# EAGLE board lost60V3 (EAGLE 9.6.0), part 1 of 3
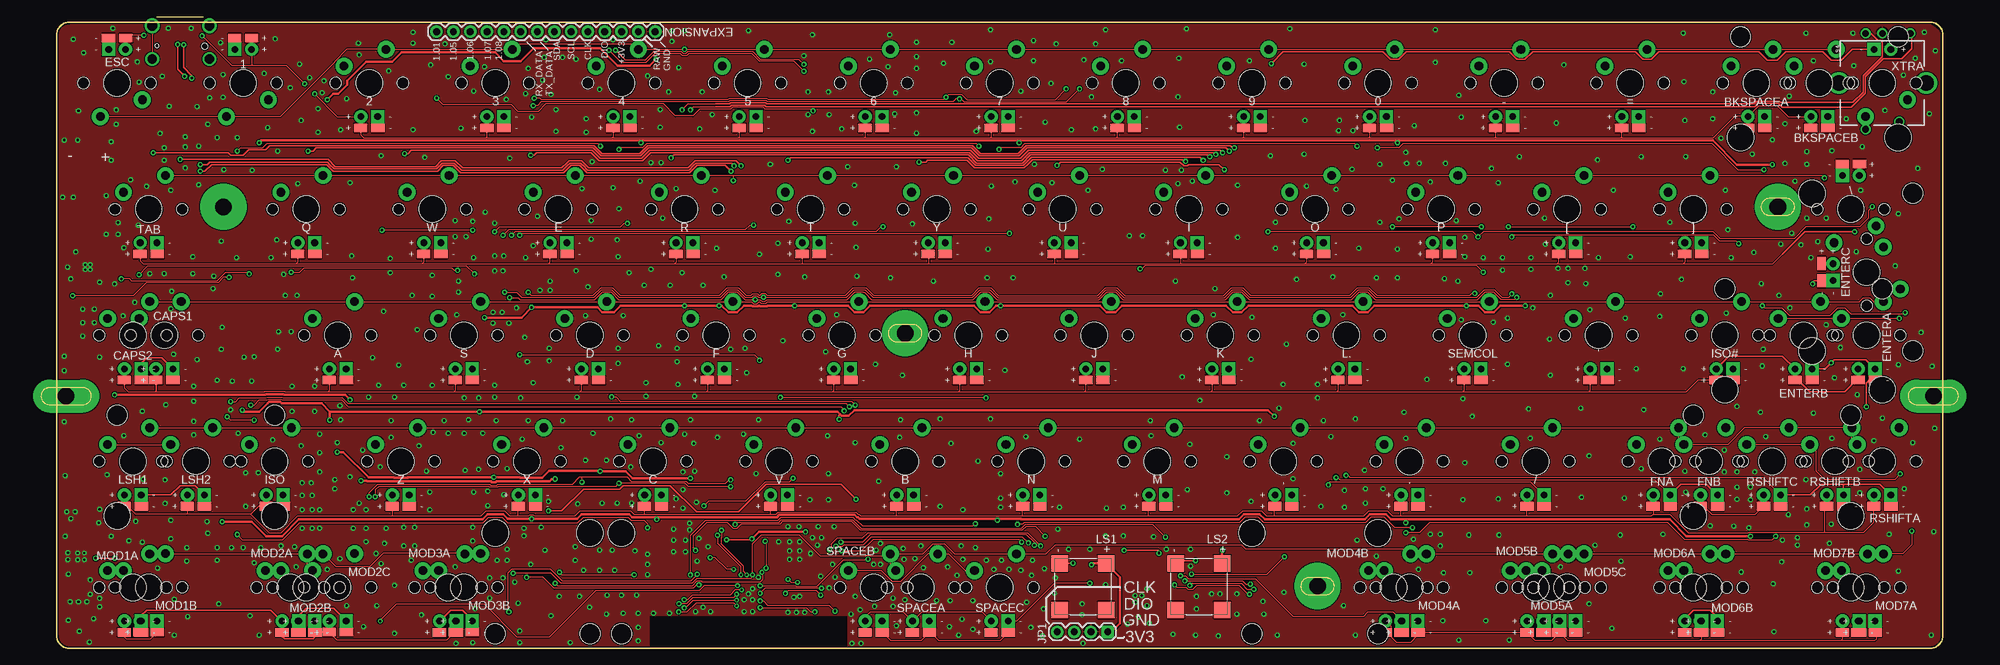
[diagram p8: board, top side]
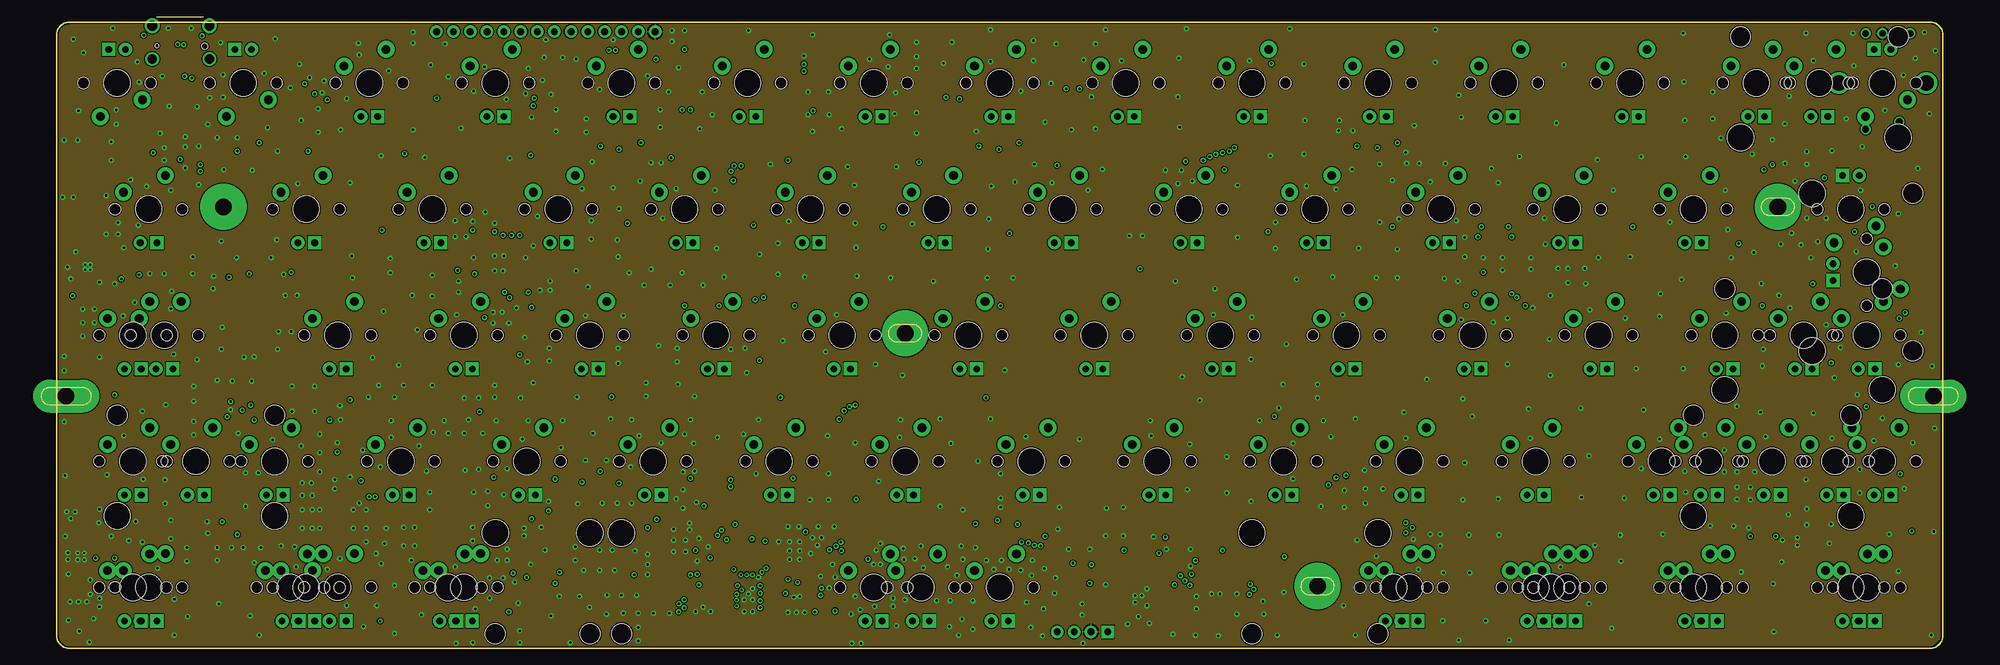
[diagram p9: board, inner layer Route2]
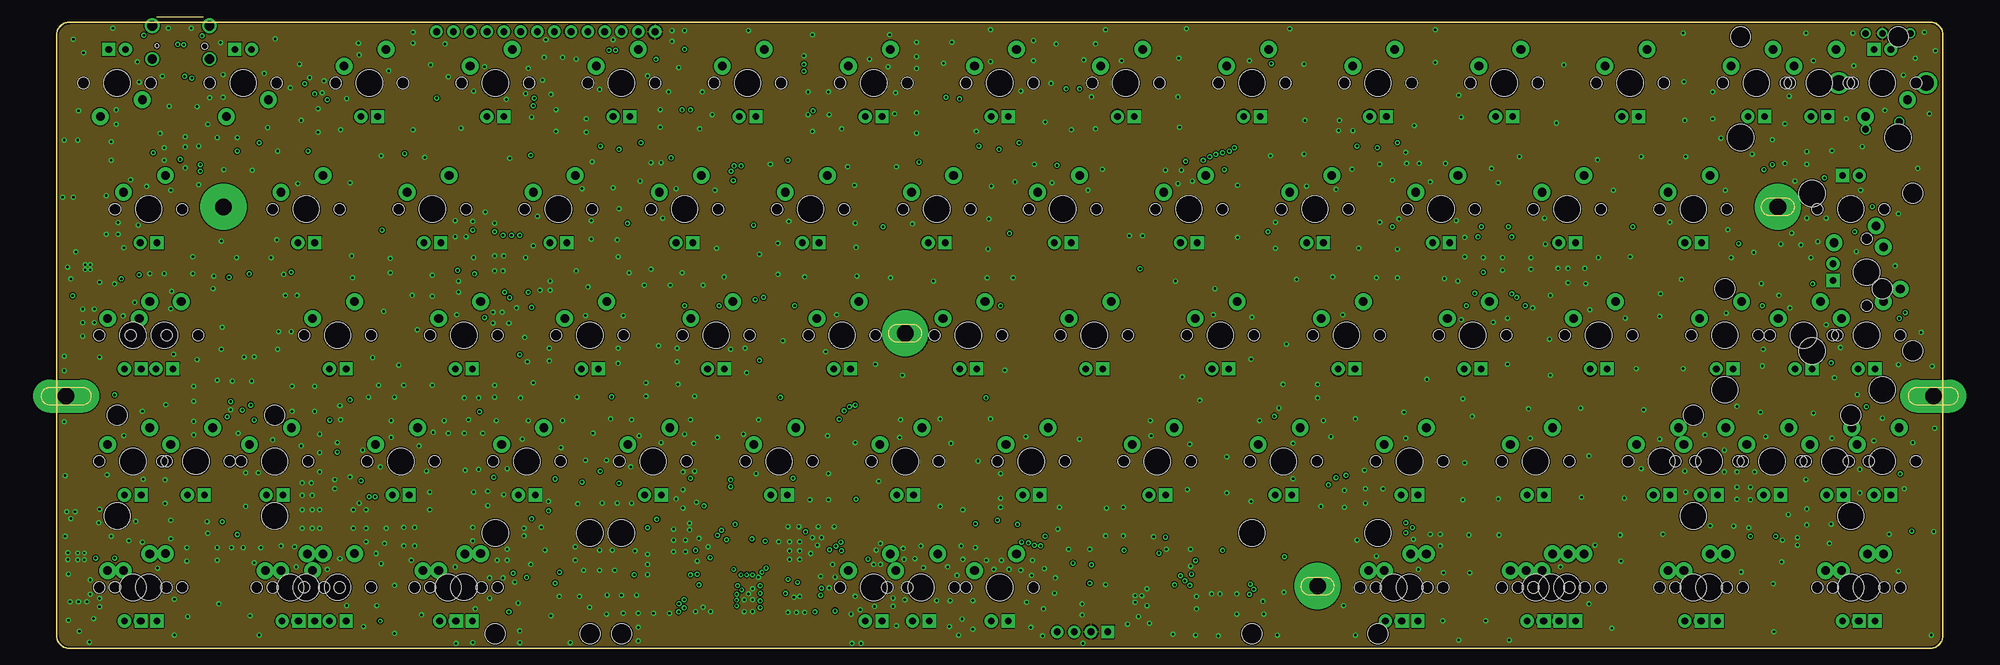
[diagram p10: board, inner layer Route15]
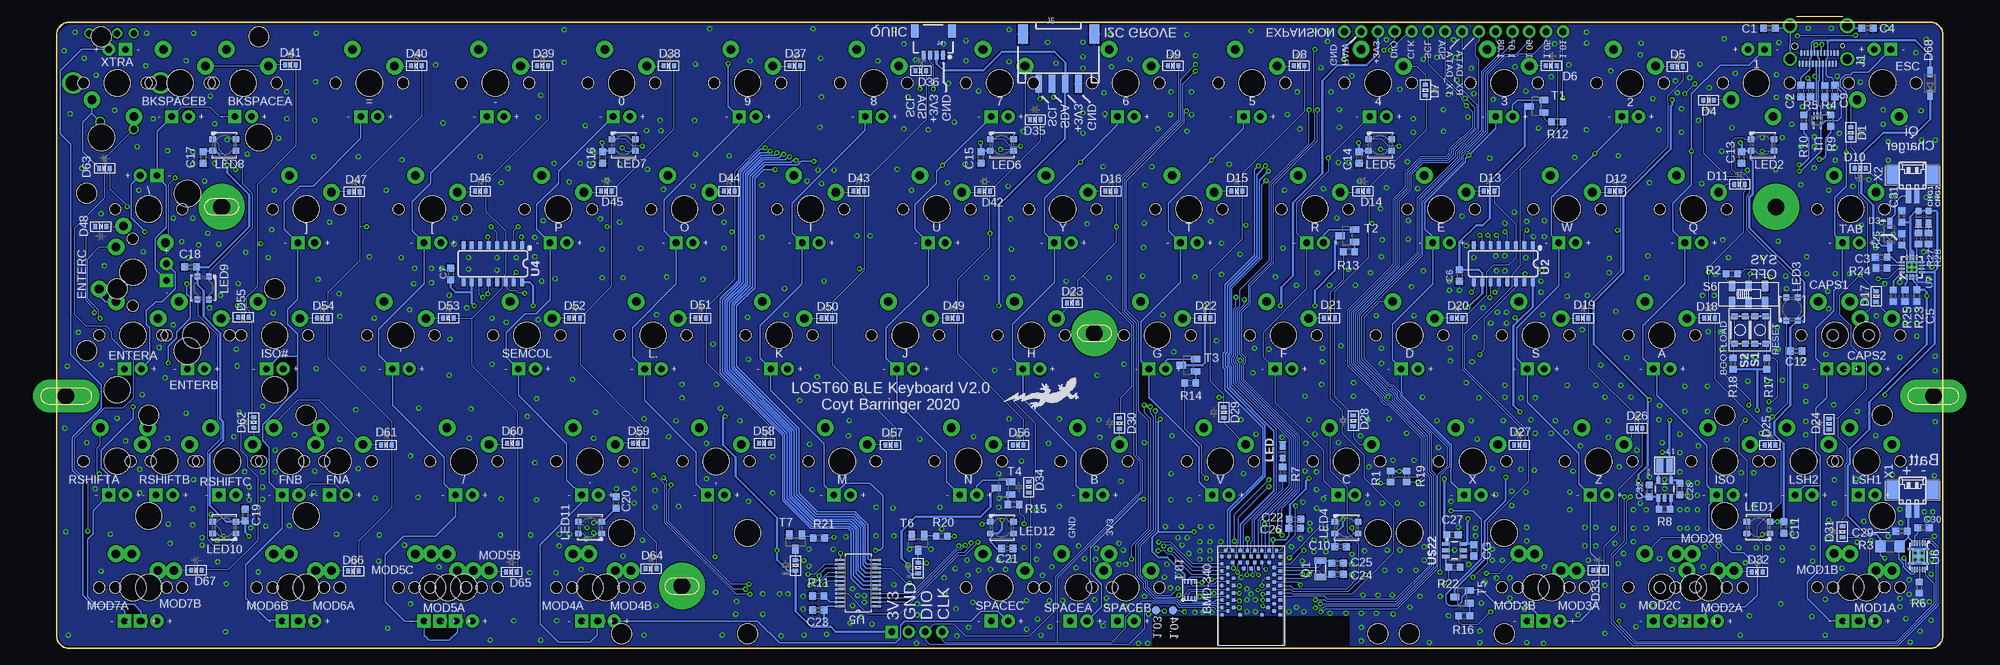
[diagram p11: board, bottom side, seen from below]

Size 285 x 95.44 mm. Coordinates in mm from the lower left corner, seen from the top.
Outline: 15.13,95.44 22.13,95.44
Outline: 0,2 arc90 2,0 283,0 arc90 285,2 285,92.6 arc90 283,94.6 2,94.6 arc90 0,92.6 0,2
Copper layers (1*16): Top 0.035mm / dielectric 1.5mm / Bottom 0.035mm
Design rules "default *": minimum track width 6mil, minimum drill 12mil, track to track 6mil, track to pad 6mil, pad to pad 6mil, via to via 6mil, smd to smd 6mil, copper to edge 8mil, drill to drill 4mil, minimum pad ring 10mil, minimum via ring 8mil, stop-mask expansion 4mil, vias tented up to drill 15mil, thermal gap 10mil

## Footprints (pad centres in the part's own frame; a part is rotated, then mirrored left to right if it is on the bottom)
MX-1U-THTSMDLED = drill 1 pad 2: LED+ -1.27,-5.08 | drill 1 pad 2 square: LED- 1.27,-5.08 | drill 1.3 pad 2.54: MX1 -3.81,2.54; MX2 2.54,5.08 | smd 2 x 1.3: SMDLED+ -1.3,-6.785; SMDLED- 1.3,-6.785 | hole 4: 0,0 | hole 1.7: -5.08,0; 5.08,0
MX-2U-THTSMDLED = drill 1 pad 2: LED+ -1.27,-5.08 | drill 1 pad 2 square: LED- 1.27,-5.08 | drill 1.3 pad 2.54: MX1 -3.81,2.54; MX2 2.54,5.08 | smd 2 x 1.3: SMDLED+ -1.3,-6.785; SMDLED- 1.3,-6.785 | hole 4: 0,0; -11.9,-8.24; 11.9,-8.24 | hole 1.7: -5.08,0; 5.08,0 | hole 3.05: -11.9,7; 11.9,7
BMD-340 = smd 0.5 x 0.5: P1 0.5,9.35; P2 1.4,8.8; P3 0.5,8.25; P4 1.4,7.7; P5 0.5,7.15; P6 1.4,6.6; P7 0.5,6.05; P8 1.4,5.5; P9 0.5,4.95; P10 1.4,4.4; P11 0.5,3.85; P12 1.4,3.3; P13 0.5,2.75; P14 1.4,2.2; P15 0.5,1.65; P16 0.5,0.55; P17 1.6,0.55; P18 2.15,1.45; P19 2.7,0.55; P20 3.25,1.45; P21 3.8,0.55; P22 4.35,1.45; P23 4.9,0.55; P24 5.45,1.45; P25 6,0.55; P26 6.55,1.45; P27 7.1,0.55; P28 7.65,1.45; P29 8.2,0.55; P30 9.3,0.55; P31 9.3,1.65; P32 8.4,2.2; P33 9.3,2.75; P34 8.4,3.3; P35 9.3,3.85; P36 8.4,4.4; P37 9.3,4.95; P38 8.4,5.5; P39 9.3,6.05; P40 8.4,6.6; P41 9.3,7.15; P42 8.4,7.7; P43 9.3,8.25; P44 8.4,8.8; P45 9.3,9.35; P46 6.55,9.35; P47 3.25,9.35; P48 2.3,8.25; P49 2.3,7.15; P50 2.3,6.05; P51 2.3,4.95; P52 2.3,3.85; P53 3.79,2.35; P54 4.9,2.35; P55 6,2.35; P56 7.5,3.85; P57 7.5,4.95; P58 7.5,6.05; P59 7.5,7.15; P60 7.5,8.25; P61 1.05,-0.35; P62 2.15,-0.35; P63 3.25,-0.35; P64 4.35,-0.35; P65 5.45,-0.35; P66 6.55,-0.35; P67 7.65,-0.35; P68 8.75,-0.35
C0603K = smd 1.05 x 1.08: 1 -0.875,0; 2 0.875,0
C0603 = smd 1.1 x 1: 1 -0.85,0; 2 0.85,0
LED-0603 = smd 1 x 1: A -0.877,0; C 0.877,0
SOD-523 = smd 0.8 x 0.6: A 0,-0.8; K 0,0.8
SOD123 = smd 1.6 x 0.8: 1 -1.7,0; 2 1.7,0
1X14 = drill 1.016 pad 1.88: 1 0,0; 2 2.54,0; 3 5.08,0; 4 7.62,0; 5 10.16,0; 6 12.7,0; 7 15.24,0; 8 17.78,0; 9 20.32,0; 10 22.86,0; 11 25.4,0; 12 27.94,0; 13 30.48,0; 14 33.02,0
GH60HOLETYPE3 = drill 2.499 pad 7.001: P$1 0,0
DX07S0224JJ2_USB-C = smd 0.27 x 0.9: A1 0.975,2.7; A2 1.475,2.7; A3 1.975,2.7; A4 2.475,2.7; A5 2.975,2.7; A6 3.475,2.7; A7 3.975,2.7; A8 4.475,2.7; A9 4.975,2.7; A10 5.475,2.7; A11 5.975,2.7; A12 6.475,2.7 | smd 0.27 x 0.8: B1 6.225,1.1; B2 5.725,1.1; B3 5.225,1.1; B4 4.725,1.1; B5 4.225,1.1; B6 3.725,1.1; B7 3.225,1.1; B8 2.725,1.1; B9 2.225,1.1; B10 1.725,1.1; B11 1.225,1.1; B12 0.725,1.1 | drill 1.4: SHIELD0 -0.72,2; SHIELD1 7.92,2 | drill 1.5: SHIELD2 7.92,-3.05; SHIELD3 -0.72,-3.05 | hole 0.6: 0,0; 0,0 | hole 0.9: 7.2,0.065
1X04_1MM_RA = smd 0.6 x 1.35: 1 -1.5,0; 2 -0.5,0; 3 0.5,0; 4 1.5,0 | smd 1.2 x 2: NC1 2.8,-3.675; NC2 -2.8,-3.675
HW4-SMD-2.0-90D = smd 1.01 x 2.74: 1 -3,-0.1; 2 -1,-0.1; 3 1,-0.1; 4 3,-0.1 | smd 1.5 x 3: SS1 -5.4,7.4; SS2 5.4,7.4
1X04 = drill 1.016 pad 1.88 square: 1 0,0 | drill 1.016 pad 1.88: 2 2.54,0; 3 5.08,0; 4 7.62,0
MICROBUILDER_INDUCTOR_TAIYOYUDEN_NRH2412T = smd 1 x 2: 1 -0.725,0; 2 0.725,0
LED3535 = smd 1 x 0.85: 1 -1.75,0.875; 2 -1.75,-0.875; 3 1.75,-0.875; 4 1.75,0.875
CUI_CMT-8530S-SMT = smd 2.5 x 2.5: 1 -3.5,3.5; 2 -3.5,-3.5; N 3.5,3.5; P 3.5,-3.5
3.2X1.5 = smd 1 x 1.8: 1 -1.25,0; 2 1.25,0
R0603 = smd 1 x 1.1: 1 -0.85,0; 2 0.85,0
R1206 = smd 1.6 x 1.803: 1 -1.422,0; 2 1.422,0
TACTILE_SWITCH_SMD_4.6X2.8MM = smd 0.9 x 1: 1 -2.05,-0.8; 2 2.05,-0.8; 3 2.05,0.8; 4 -2.05,0.8
ROTARY_ENC_PLAIN-MOD1 = drill 1.016: A 7.493,-4.191; B 7.493,2.54; C 7.493,0; SW+ -6.985,2.54; SW- -5.842,-2.54 | drill 2.286: P$3 0,6.604; P$4 0,-6.604
JS202011JCQN = smd 1 x 1.6: 1 -2.5,1.2; 2 0,1.2; 3 2.5,1.2; 4 -2.5,-1.2; 5 0,-1.2; 6 2.5,-1.2
MX-6.25U-THTSMDLED-FLIPPED = drill 1 pad 2: LED+ -1.27,-5.08 | drill 1 pad 2 square: LED- 1.27,-5.08 | drill 1.3 pad 2.54: MX1 -3.81,2.54; MX2 2.54,5.08 | smd 2 x 1.3: SMDLED+ -1.3,-6.785; SMDLED- 1.3,-6.785 | hole 4: 0,0; -50,8.24; 50,8.24 | hole 1.7: -5.08,0; 5.08,0 | hole 3.05: -50,-7; 50,-7
MX-7U-THTSMDLED-FLIPPED = drill 1 pad 2: LED+ -1.27,-5.08 | drill 1 pad 2 square: LED- 1.27,-5.08 | drill 1.3 pad 2.54: MX1 -3.81,2.54; MX2 2.54,5.08 | smd 2 x 1.3: SMDLED+ -1.3,-6.785; SMDLED- 1.3,-6.785 | hole 4: 0,0; -57.15,8.24; 57.15,8.24 | hole 1.7: -5.08,0; 5.08,0 | hole 3.05: -57.15,-7; 57.15,-7
SOT23 = smd 1 x 1.4: 1 -0.95,-1.1; 2 0.95,-1.1; 3 0,1.1
PAD.03X.05 = smd 1.27 x 1.27: P$1 0,0
SOT50P160X60-5N = smd 1.118 x 0.254: 1 -0.737,0.508; 2 -0.737,0; 3 -0.737,-0.508 | smd 1.118 x 0.305: 4 0.737,-0.508; 5 0.737,0.508
SO16 = smd 0.6 x 1.2: 1 -4.445,-2.8; 2 -3.175,-2.8; 3 -1.905,-2.8; 4 -0.635,-2.8; 5 0.635,-2.8; 6 1.905,-2.8; 7 3.175,-2.8; 8 4.445,-2.8; 9 4.445,2.8; 10 3.175,2.8; 11 1.905,2.8; 12 0.635,2.8; 13 -0.635,2.8; 14 -1.905,2.8; 15 -3.175,2.8; 16 -4.445,2.8
MICROBUILDER_USON8 = smd 0.5 x 0.275: 1 -1.2,0.75; 2 -1.2,0.25; 3 -1.2,-0.25; 4 -1.2,-0.75; 5 1.2,-0.75; 6 1.2,-0.25; 7 1.2,0.25; 8 1.2,0.75
SOP63P600X175-28N = smd 1.6 x 0.356: 1 -2.667,3.505; 2 -2.667,2.845; 3 -2.667,2.235; 4 -2.667,1.575; 5 -2.667,0.965; 6 -2.667,0.305; 7 -2.667,-0.305; 8 -2.667,-0.965; 9 -2.667,-1.575; 10 -2.667,-2.235; 11 -2.667,-2.845; 12 -2.667,-3.505; 13 2.667,-3.505; 14 2.667,-2.845; 15 2.667,-2.235; 16 2.667,-1.575; 17 2.667,-0.965; 18 2.667,-0.305; 19 2.667,0.305; 20 2.667,0.965; 21 2.667,1.575; 22 2.667,2.235; 23 2.667,2.845; 24 2.667,3.505
PDSO-N12 = smd 0.2 x 0.85: 1 -1,-1.975; 2 -0.6,-1.975; 3 -0.2,-1.975; 4 0.2,-1.975; 5 0.6,-1.975; 6 1,-1.975; 7 1,1.975; 8 0.6,1.975; 9 0.2,1.975; 10 -0.2,1.975; 11 -0.6,1.975; 12 -1,1.975 | smd 1.95 x 1.95: EP 0,0 | smd 1 x 0.25: EP1 -1.15,1.1; EP2 -1.15,-1.1; EP3 1.15,-1.1; EP4 1.15,1.1
PVQFN-N16 = smd 0.28 x 0.85: 1 -0.75,-1.475; 2 -0.25,-1.475; 3 0.25,-1.475; 4 0.75,-1.475; 9 0.75,1.475; 10 0.25,1.475; 11 -0.25,1.475; 12 -0.75,1.475 | smd 0.85 x 0.28: 5 1.475,-0.75; 6 1.475,-0.25; 7 1.475,0.25; 8 1.475,0.75; 13 -1.475,0.75; 14 -1.475,0.25; 15 -1.475,-0.25; 16 -1.475,-0.75 | smd 1.7 x 1.7: EP 0,0
SOT23-6 = smd 0.55 x 1.2: 1 0.95,1.3; 2 0,1.3; 3 -0.95,1.3; 4 -0.95,-1.3; 5 0,-1.3; 6 0.95,-1.3
SOT23-5 = smd 0.55 x 1.2: 1 -0.95,-1.3; 2 0,-1.3; 3 0.95,-1.3; 4 0.95,1.3; 5 -0.95,1.3
GH60HOLE = drill 2.499 pad 5.001 long: P$1 0,0
GH60HOLETYPE2 = drill 2.499 pad 7: P$1 0,0
53261-02 = smd 0.8 x 2: 1 0.625,-2.5; 2 -0.625,-2.5 | smd 2.1 x 3: S1 3.125,0.625; S2 -3.125,0.625
MX-1U-THTSMDLED-MOD1 = drill 1 pad 2: LED+ -1.27,-5.08 | drill 1 pad 2 square: LED- 1.27,-5.08 | drill 1.3 pad 2.54: MX1 -3.81,2.54; MX2 2.54,5.08 | hole 4: 0,0 | hole 1.7: -5.08,0; 5.08,0

## Placement (x,y rotation side)
0  KEYSWITCH-THTSMDLED-MX-1U-THTSMDLED  [MX-1U-THTSMDLED]  199.65,85.4 0 top
1  KEYSWITCH-THTSMDLED-MX-1U-THTSMDLED  [MX-1U-THTSMDLED]  28.2,85.4 180 top
2  KEYSWITCH-THTSMDLED-MX-1U-THTSMDLED  [MX-1U-THTSMDLED]  47.25,85.4 0 top
3  KEYSWITCH-THTSMDLED-MX-1U-THTSMDLED  [MX-1U-THTSMDLED]  66.3,85.4 0 top
4  KEYSWITCH-THTSMDLED-MX-1U-THTSMDLED  [MX-1U-THTSMDLED]  85.35,85.4 0 top
5  KEYSWITCH-THTSMDLED-MX-1U-THTSMDLED  [MX-1U-THTSMDLED]  104.4,85.4 0 top
6  KEYSWITCH-THTSMDLED-MX-1U-THTSMDLED  [MX-1U-THTSMDLED]  123.45,85.4 0 top
7  KEYSWITCH-THTSMDLED-MX-1U-THTSMDLED  [MX-1U-THTSMDLED]  142.5,85.4 0 top
8  KEYSWITCH-THTSMDLED-MX-1U-THTSMDLED  [MX-1U-THTSMDLED]  161.55,85.4 0 top
9  KEYSWITCH-THTSMDLED-MX-1U-THTSMDLED  [MX-1U-THTSMDLED]  180.6,85.4 0 top
'  KEYSWITCH-THTSMDLED-MX-1U-THTSMDLED  [MX-1U-THTSMDLED]  232.99,47.3 0 top
,  KEYSWITCH-THTSMDLED-MX-1U-THTSMDLED  [MX-1U-THTSMDLED]  185.36,28.25 0 top
-  KEYSWITCH-THTSMDLED-MX-1U-THTSMDLED  [MX-1U-THTSMDLED]  218.7,85.4 0 top
.  KEYSWITCH-THTSMDLED-MX-1U-THTSMDLED  [MX-1U-THTSMDLED]  204.41,28.25 0 top
/  KEYSWITCH-THTSMDLED-MX-1U-THTSMDLED  [MX-1U-THTSMDLED]  223.46,28.25 0 top
=  KEYSWITCH-THTSMDLED-MX-1U-THTSMDLED  [MX-1U-THTSMDLED]  237.75,85.4 0 top
[  KEYSWITCH-THTSMDLED-MX-1U-THTSMDLED  [MX-1U-THTSMDLED]  228.22,66.35 0 top
\  KEYSWITCH-THTSMDLED-MX-1U-THTSMDLED  [MX-1U-THTSMDLED]  271.09,66.35 180 top
]  KEYSWITCH-THTSMDLED-MX-1U-THTSMDLED  [MX-1U-THTSMDLED]  247.27,66.35 0 top
A  KEYSWITCH-THTSMDLED-MX-1U-THTSMDLED  [MX-1U-THTSMDLED]  42.48,47.3 0 top
B  KEYSWITCH-THTSMDLED-MX-1U-THTSMDLED  [MX-1U-THTSMDLED]  128.21,28.25 0 top
BKSPACEA  KEYSWITCH-THTSMDLED-MX-1U-THTSMDLED  [MX-1U-THTSMDLED]  256.8,85.4 0 top
BKSPACEB  KEYSWITCH-THTSMDLED-MX-2U-THTSMDLED  [MX-2U-THTSMDLED]  266.32,85.4 0 top
BMD-340  BMD-340  [BMD-340]  99.64,14.44 180 bottom
C  KEYSWITCH-THTSMDLED-MX-1U-THTSMDLED  [MX-1U-THTSMDLED]  90.11,28.25 0 top
C1  100pF  [C0603K]  26.23,93.69 0 bottom
C2  3.3uF  [C0603K]  21.44,84.19 270 bottom
C3  1uF  [C0603K]  9.32,59.09 180 bottom
C4  100pF  [C0603K]  11.37,93.69 180 bottom
C5  10uF  [C0603K]  3.95,53.27 270 bottom
C6  1uF  [C0603K]  73.04,56.32 270 bottom
C7  1uF  [C0603K]  225.44,56.57 90 bottom
C9  3.3uF  [C0603K]  16.3,84.2 270 bottom
C10  0.1uF  [C0603K]  90.97,15.37 0 bottom
C11  0.1uF  [C0603K]  24.07,18.25 270 bottom
C12  0.1uF  [C0603K]  22.16,44.92 0 bottom
C13  0.1uF  [C0603K]  30.42,74.13 270 bottom
C14  0.1uF  [C0603K]  88.2,74.13 270 bottom
C15  0.1uF  [C0603K]  145.35,74.13 270 bottom
C16  0.1uF  [C0603K]  202.5,74.13 270 bottom
C17  0.1uF  [C0603K]  262.83,74.13 270 bottom
C18  0.1uF  [C0603K]  264.74,57.62 180 bottom
C19  0.1uF  [C0603K]  256.48,20.16 90 bottom
C20  0.1uF  [C0603K]  200.47,22.06 90 bottom
C21  0.1uF  [C0603K]  141.37,15.08 0 bottom
C22  1uF  [C0603K]  97.9,19.48 0 bottom
C23  1uF  [C0603K]  169.93,5.8 180 bottom
C24  15pF  [C0603K]  91.44,11.2 180 bottom
C25  15pF  [C0603K]  91.44,12.85 180 bottom
C26  10uF  [C0603K]  97.92,18.12 0 bottom
C27  1uF  [C0603]  74.11,17.17 0 bottom
C28  22uF  [C0603K]  39.76,24.06 270 bottom
C29  1uF  [C0603K]  6.24,17.71 180 bottom
C30  0.47uF  [C0603K]  2.93,18.22 0 bottom
C31  10uF  [C0603K]  6.24,65.21 90 bottom
C32  10µF  [C0603K]  44.34,23.81 90 bottom
CAPS1  KEYSWITCH-THTSMDLED-MX-1U-THTSMDLED  [MX-1U-THTSMDLED]  16.29,47.3 0 top
CAPS2  KEYSWITCH-THTSMDLED-MX-1U-THTSMDLED  [MX-1U-THTSMDLED]  11.53,47.3 0 top
CG  4.7uF  [C0603]  70.87,14.82 270 bottom
CHG1  ORANGE  [LED-0603]  3.7,65.21 270 bottom
CHG2  ORANGE  [LED-0603]  2.17,65.21 270 bottom
D  KEYSWITCH-THTSMDLED-MX-1U-THTSMDLED  [MX-1U-THTSMDLED]  80.58,47.3 0 top
D1  [SOD-523]  13.91,77.94 0 bottom
D2  [SOD-523]  154.83,12.12 180 bottom
D3  MBR120  [SOD123]  8.04,62.51 90 bottom
D4  [SOD-523]  35.41,82.79 270 bottom
D5  [SOD-523]  40.11,87.87 90 bottom
D6  [SOD-523]  59.16,88 90 bottom
D7  [SOD-523]  78.19,84.36 0 bottom
D8  [SOD-523]  97.26,88 90 bottom
D9  [SOD-523]  116.31,88 90 bottom
D10  [SOD-523]  12.49,72.52 270 bottom
D11  [SOD-523]  30.72,70.09 90 bottom
D12  [SOD-523]  49.51,69.07 90 bottom
D13  [SOD-523]  68.56,69.07 90 bottom
D14  [SOD-523]  87.61,69.07 90 bottom
D15  [SOD-523]  106.66,69.07 90 bottom
D16  [SOD-523]  125.71,69.07 90 bottom
D17  [SOD-523]  10.1,53.18 180 bottom
D18  [SOD-523]  35.29,49.9 90 bottom
D19  [SOD-523]  54.34,49.9 90 bottom
D20  [SOD-523]  73.39,49.9 90 bottom
D21  [SOD-523]  92.69,49.9 90 bottom
D22  [SOD-523]  111.49,49.9 90 bottom
D23  [SOD-523]  131.55,52.18 90 bottom
D24  [SOD-523]  17.21,33.87 180 bottom
D25  [SOD-523]  26.14,30.72 90 bottom
D26  [SOD-523]  46.21,33.26 90 bottom
D27  [SOD-523]  63.99,30.72 90 bottom
D28  [SOD-523]  89.09,34.38 180 bottom
D29  [SOD-523]  108.65,35.65 180 bottom
D30  [SOD-523]  124.4,34 180 bottom
D31  [SOD-523]  15.18,17.62 180 bottom
D32  [SOD-523]  28.05,11.54 90 bottom
D33  [SOD-523]  52.05,11.8 90 bottom
D34  [SOD-523]  138.12,24.35 180 bottom
D35  [SOD-523]  137.14,79.87 90 bottom
D36  [SOD-523]  154.41,87.24 90 bottom
D37  [SOD-523]  173.46,88 90 bottom
D38  [SOD-523]  192.51,88 90 bottom
D39  [SOD-523]  211.56,88 90 bottom
D40  [SOD-523]  230.61,88 90 bottom
D41  [SOD-523]  249.66,88.12 90 bottom
D42  [SOD-523]  144.76,69.07 90 bottom
D43  [SOD-523]  163.81,69.07 90 bottom
D44  [SOD-523]  183.37,69.07 90 bottom
D45  [SOD-523]  201.91,69.07 90 bottom
D46  [SOD-523]  220.96,69.07 90 bottom
D47  [SOD-523]  240.01,68.95 90 bottom
D48  [SOD-523]  278.32,63.72 270 bottom
D49  [SOD-523]  149.59,49.9 90 bottom
D50  [SOD-523]  168.64,49.9 90 bottom
D51  [SOD-523]  187.69,49.9 90 bottom
D52  [SOD-523]  206.74,49.9 90 bottom
D53  [SOD-523]  225.79,49.9 90 bottom
D54  [SOD-523]  244.84,49.9 90 bottom
D55  [SOD-523]  256.78,50.02 90 bottom
D56  [SOD-523]  139.68,30.72 90 bottom
D57  [SOD-523]  158.99,30.72 90 bottom
D58  [SOD-523]  178.04,30.97 90 bottom
D59  [SOD-523]  197.09,30.97 90 bottom
D60  [SOD-523]  216.14,30.97 90 bottom
D61  [SOD-523]  235.19,30.72 90 bottom
D62  [SOD-523]  255.21,34.12 180 bottom
D63  [SOD-523]  277.73,72.5 90 bottom
D64  [SOD-523]  195.18,12.05 90 bottom
D65  [SOD-523]  216.26,11.54 90 bottom
D66  [SOD-523]  240.14,11.67 90 bottom
D67  [SOD-523]  263.89,11.8 90 bottom
D68  MBR120  [SOD123]  1.95,85.35 90 bottom
D69  [SOD-523]  173.37,12.5 180 bottom
E  KEYSWITCH-THTSMDLED-MX-1U-THTSMDLED  [MX-1U-THTSMDLED]  75.82,66.35 0 top
ENTERA  KEYSWITCH-THTSMDLED-MX-1U-THTSMDLED  [MX-1U-THTSMDLED]  273.47,47.3 0 top
ENTERB  KEYSWITCH-THTSMDLED-MX-2U-THTSMDLED  [MX-2U-THTSMDLED]  263.94,47.3 0 top
ENTERC  KEYSWITCH-THTSMDLED-MX-2U-THTSMDLED  [MX-2U-THTSMDLED]  273.47,56.83 270 top
ESC  KEYSWITCH-THTSMDLED-MX-1U-THTSMDLED  [MX-1U-THTSMDLED]  9.15,85.4 180 top
EXPANSION  [1X14]  90.44,93.15 180 top
F  KEYSWITCH-THTSMDLED-MX-1U-THTSMDLED  [MX-1U-THTSMDLED]  99.64,47.3 0 top
FNA  KEYSWITCH-THTSMDLED-MX-1U-THTSMDLED  [MX-1U-THTSMDLED]  242.51,28.25 0 top
FNB  KEYSWITCH-THTSMDLED-MX-1U-THTSMDLED  [MX-1U-THTSMDLED]  249.65,28.25 0 top
G  KEYSWITCH-THTSMDLED-MX-1U-THTSMDLED  [MX-1U-THTSMDLED]  118.69,47.3 0 top
GND  GH60HOLETYPE3  [GH60HOLETYPE3]  25.2,66.7 0 top
H  KEYSWITCH-THTSMDLED-MX-1U-THTSMDLED  [MX-1U-THTSMDLED]  137.74,47.3 0 top
I  KEYSWITCH-THTSMDLED-MX-1U-THTSMDLED  [MX-1U-THTSMDLED]  171.07,66.35 0 top
ISO  KEYSWITCH-THTSMDLED-MX-1U-THTSMDLED  [MX-1U-THTSMDLED]  32.96,28.25 0 top
ISO#  KEYSWITCH-THTSMDLED-MX-1U-THTSMDLED  [MX-1U-THTSMDLED]  252.03,47.3 0 top
J  KEYSWITCH-THTSMDLED-MX-1U-THTSMDLED  [MX-1U-THTSMDLED]  156.78,47.3 0 top
J1  [DX07S0224JJ2_USB-C]  15.18,91.02 180 bottom
J4  [1X04_1MM_RA]  152.54,89.59 180 bottom
J5  4P-SMD-2.0-90D  [HW4-SMD-2.0-90D]  133.62,85.4 0 bottom
JP1  [1X04]  158.82,2.5 180 top
K  KEYSWITCH-THTSMDLED-MX-1U-THTSMDLED  [MX-1U-THTSMDLED]  175.84,47.3 0 top
L1  2.2uH/NRH2412T2R2MNGH  [MICROBUILDER_INDUCTOR_TAIYOYUDEN_NRH2412T]  42.05,27.62 0 bottom
L.  KEYSWITCH-THTSMDLED-MX-1U-THTSMDLED  [MX-1U-THTSMDLED]  194.88,47.3 0 top
LED  RED  [LED-0603]  99.76,29.62 90 bottom
LED1  WS2812B3535  [LED3535]  27.88,18.25 180 bottom
LED2  WS2812B3535  [LED3535]  27.24,76.03 0 bottom
LED3  WS2812B3535  [LED3535]  22.8,51.27 90 bottom
LED4  WS2812B3535  [LED3535]  90.11,18.25 0 bottom
LED5  WS2812B3535  [LED3535]  85.03,76.03 0 bottom
LED6  WS2812B3535  [LED3535]  142.18,76.03 0 bottom
LED7  WS2812B3535  [LED3535]  199.33,76.03 0 bottom
LED8  WS2812B3535  [LED3535]  259.65,76.03 0 bottom
LED9  WS2812B3535  [LED3535]  262.83,54.45 270 bottom
LED10  WS2812B3535  [LED3535]  259.65,18.25 180 bottom
LED11  WS2812B3535  [LED3535]  204.41,18.25 180 bottom
LED12  WS2812B3535  [LED3535]  142.18,18.25 0 bottom
LS1  CMT-8530S-SMT  [CUI_CMT-8530S-SMT]  155.08,9.33 90 top
LS2  CMT-8530S-SMT  [CUI_CMT-8530S-SMT]  172.61,9.33 90 top
LSH1  KEYSWITCH-THTSMDLED-MX-1U-THTSMDLED  [MX-1U-THTSMDLED]  11.53,28.25 0 top
LSH2  KEYSWITCH-THTSMDLED-MX-2U-THTSMDLED  [MX-2U-THTSMDLED]  21.05,28.25 0 top
M  KEYSWITCH-THTSMDLED-MX-1U-THTSMDLED  [MX-1U-THTSMDLED]  166.31,28.25 0 top
MOD1A  KEYSWITCH-THTSMDLED-MX-1U-THTSMDLED  [MX-1U-THTSMDLED]  11.53,9.2 0 top
MOD1B  KEYSWITCH-THTSMDLED-MX-1U-THTSMDLED  [MX-1U-THTSMDLED]  13.91,9.23 0 top
MOD2A  KEYSWITCH-THTSMDLED-MX-1U-THTSMDLED  [MX-1U-THTSMDLED]  35.34,9.2 0 top
MOD2B  KEYSWITCH-THTSMDLED-MX-1U-THTSMDLED  [MX-1U-THTSMDLED]  37.72,9.2 0 top
MOD2C  KEYSWITCH-THTSMDLED-MX-1U-THTSMDLED  [MX-1U-THTSMDLED]  42.48,9.23 0 top
MOD3A  KEYSWITCH-THTSMDLED-MX-1U-THTSMDLED  [MX-1U-THTSMDLED]  59.15,9.2 0 top
MOD3B  KEYSWITCH-THTSMDLED-MX-1U-THTSMDLED  [MX-1U-THTSMDLED]  61.53,9.23 0 top
MOD4A  KEYSWITCH-THTSMDLED-MX-1U-THTSMDLED  [MX-1U-THTSMDLED]  204.41,9.2 0 top
MOD4B  KEYSWITCH-THTSMDLED-MX-1U-THTSMDLED  [MX-1U-THTSMDLED]  202.03,9.2 0 top
MOD5A  KEYSWITCH-THTSMDLED-MX-1U-THTSMDLED  [MX-1U-THTSMDLED]  225.84,9.2 0 top
MOD5B  KEYSWITCH-THTSMDLED-MX-1U-THTSMDLED  [MX-1U-THTSMDLED]  223.46,9.2 0 top
MOD5C  KEYSWITCH-THTSMDLED-MX-1U-THTSMDLED  [MX-1U-THTSMDLED]  228.22,9.2 0 top
MOD6A  KEYSWITCH-THTSMDLED-MX-1U-THTSMDLED  [MX-1U-THTSMDLED]  247.27,9.2 0 top
MOD6B  KEYSWITCH-THTSMDLED-MX-1U-THTSMDLED  [MX-1U-THTSMDLED]  249.65,9.2 0 top
MOD7A  KEYSWITCH-THTSMDLED-MX-1U-THTSMDLED  [MX-1U-THTSMDLED]  273.47,9.2 0 top
MOD7B  KEYSWITCH-THTSMDLED-MX-1U-THTSMDLED  [MX-1U-THTSMDLED]  271.09,9.2 0 top
N  KEYSWITCH-THTSMDLED-MX-1U-THTSMDLED  [MX-1U-THTSMDLED]  147.26,28.25 0 top
O  KEYSWITCH-THTSMDLED-MX-1U-THTSMDLED  [MX-1U-THTSMDLED]  190.12,66.35 0 top
P  KEYSWITCH-THTSMDLED-MX-1U-THTSMDLED  [MX-1U-THTSMDLED]  209.17,66.35 0 top
Q  KEYSWITCH-THTSMDLED-MX-1U-THTSMDLED  [MX-1U-THTSMDLED]  37.72,66.35 0 top
Q1  32.768kHz  [3.2X1.5]  94.05,12.03 270 bottom
R  KEYSWITCH-THTSMDLED-MX-1U-THTSMDLED  [MX-1U-THTSMDLED]  94.87,66.35 0 top
R1  1k  [R0603]  83.45,25.97 270 bottom
R2  1k  [R0603]  31.89,56.57 0 bottom
R3  0.01  [R1206]  8.01,15.43 180 bottom
R4  5.1k  [R0603]  17.85,84.16 90 bottom
R5  5.1k  [R0603]  20.01,84.16 90 bottom
R6  2.7k  [R0603]  3.57,9.2 270 bottom
R7  1k  [R0603]  99.74,26.55 90 bottom
R8  100k  [R0603]  42.05,21.01 0 bottom
R9  30  [R0603]  16.96,79.72 270 bottom
R10  30  [R0603]  21.02,79.72 270 bottom
R11  5.1k  [R0603]  169.93,7.9 180 bottom
R12  5.1k  [R0603]  58.25,79.53 0 bottom
R13  5.1k  [R0603]  89.73,59.91 180 bottom
R14  5.1k  [R0603]  113.73,40.09 180 bottom
R15  5.1k  [R0603]  140.42,21.75 0 bottom
R16  5.1k  [R0603]  72.33,4.91 180 bottom
R17  10k  [R0603]  26.61,43.02 270 bottom
R18  10k  [R0603]  31.69,43.02 270 bottom
R19  1k  [R0603]  81.04,25.97 270 bottom
R20  5.1k  [R0603]  151.27,16.95 0 bottom
R21  5.1k  [R0603]  169.81,16.7 0 bottom
R22  100k  [R0603]  73.8,12.25 180 bottom
R23  10k  [R0603]  5.73,53.27 90 bottom
R24  0  [R0603]  9.28,57.46 0 bottom
R25  590  [R0603]  7.51,53.27 90 bottom
R26  1.1k  [R0603]  6.24,61.78 270 bottom
R27  1k  [R0603]  3.7,61.91 90 bottom
R28  1k  [R0603]  2.17,61.91 90 bottom
RSHIFTA  KEYSWITCH-THTSMDLED-MX-1U-THTSMDLED  [MX-1U-THTSMDLED]  275.85,28.25 0 top
RSHIFTB  KEYSWITCH-THTSMDLED-MX-1U-THTSMDLED  [MX-1U-THTSMDLED]  268.7,28.25 0 top
RSHIFTC  KEYSWITCH-THTSMDLED-MX-2U-THTSMDLED  [MX-2U-THTSMDLED]  259.18,28.25 0 top
S  KEYSWITCH-THTSMDLED-MX-1U-THTSMDLED  [MX-1U-THTSMDLED]  61.53,47.3 0 top
S1  MOMENTARY-SWITCH-SPST-SMD-4.6X2.8MM  [TACTILE_SWITCH_SMD_4.6X2.8MM]  27.63,48.09 270 bottom
S2  MOMENTARY-SWITCH-SPST-SMD-4.6X2.8MM  [TACTILE_SWITCH_SMD_4.6X2.8MM]  30.67,48.09 90 bottom
S4  ENCODER-SWITCH-MOD1  [ROTARY_ENC_PLAIN-MOD1]  275.86,85.4 90 top
S6  JS202011JCQN  [JS202011JCQN]  29.35,53.53 0 bottom
SEMCOL  KEYSWITCH-THTSMDLED-MX-1U-THTSMDLED  [MX-1U-THTSMDLED]  213.94,47.3 0 top
SPACEA  KEYSWITCH-THTSMDLED-MX-6.25U-THTSMDLED-FLIPPED  [MX-6.25U-THTSMDLED-FLIPPED]  130.59,9.2 0 top
SPACEB  KEYSWITCH-THTSMDLED-MX-7U-THTSMDLED-FLIPPED  [MX-7U-THTSMDLED-FLIPPED]  123.45,9.2 0 top
SPACEC  KEYSWITCH-THTSMDLED-MX-7U-THTSMDLED-FLIPPED  [MX-7U-THTSMDLED-FLIPPED]  142.5,9.2 0 top
T  KEYSWITCH-THTSMDLED-MX-1U-THTSMDLED  [MX-1U-THTSMDLED]  113.92,66.35 0 top
T1  BC848  [SOT23]  61.41,81.88 90 bottom
T2  BC848  [SOT23]  89.98,62.32 90 bottom
T3  BC848  [SOT23]  113.99,42.76 90 bottom
T4  BC848  [SOT23]  141.93,24.22 90 bottom
T5  BC848  [SOT23]  72.65,7.77 90 bottom
T6  BC848  [SOT23]  154.83,15.93 180 bottom
T7  BC848  [SOT23]  173.37,16.06 180 bottom
TAB  KEYSWITCH-THTSMDLED-MX-1U-THTSMDLED  [MX-1U-THTSMDLED]  13.91,66.35 0 top
TP1  TEST-POINT3X5  [PAD.03X.05]  116.34,5.77 0 bottom
TP2  TEST-POINT3X5  [PAD.03X.05]  118.88,5.77 0 bottom
U  KEYSWITCH-THTSMDLED-MX-1U-THTSMDLED  [MX-1U-THTSMDLED]  152.02,66.35 0 top
U1  TPD3E001DRLR  [SOT50P160X60-5N]  18.99,79.72 270 bottom
U2  SN74HC595D  [SO16]  66.43,58.1 180 bottom
U3  GD25Q16CEIGR  [MICROBUILDER_USON8]  113.8,8.82 90 bottom
U4  SN74HC595D  [SO16]  219.09,58.1 180 bottom
U5  TLC59281DBQR  [SOP63P600X175-28N]  163.9,9.87 180 bottom
U6  BQ27441-G1  [PDSO-N12]  3.7,13.9 180 bottom
U7  BQ24075  [PVQFN-N16]  4.71,57.59 0 bottom
U$22  TPS22810*  [SOT23-6]  73.79,14.82 90 bottom
U$38  LM3671  [SOT23-5]  42.05,24.06 0 bottom
U$125  GH60HOLE  [GH60HOLE]  283.54,38.1 0 top
U$126  GH60HOLE  [GH60HOLE]  1.46,38.1 0 top
U$130  GH60HOLETYPE2  [GH60HOLETYPE2]  128.2,47.6 0 top
U$131  GH60HOLETYPE2  [GH60HOLETYPE2]  260.05,66.7 0 top
U$132  GH60HOLETYPE2  [GH60HOLETYPE2]  190.5,9.4 0 top
V  KEYSWITCH-THTSMDLED-MX-1U-THTSMDLED  [MX-1U-THTSMDLED]  109.16,28.25 0 top
W  KEYSWITCH-THTSMDLED-MX-1U-THTSMDLED  [MX-1U-THTSMDLED]  56.77,66.35 0 top
X  KEYSWITCH-THTSMDLED-MX-1U-THTSMDLED  [MX-1U-THTSMDLED]  71.06,28.25 0 top
X1  MOLEX_53261-02  [53261-02]  4.58,23.2 0 bottom
X2  MOLEX_53261-02  [53261-02]  4.58,70.77 0 bottom
XTRA  KEYSWITCH-THTSMDLED-MOD1  [MX-1U-THTSMDLED-MOD1]  275.85,85.4 180 top
Y  KEYSWITCH-THTSMDLED-MX-1U-THTSMDLED  [MX-1U-THTSMDLED]  132.97,66.35 0 top
Z  KEYSWITCH-THTSMDLED-MX-1U-THTSMDLED  [MX-1U-THTSMDLED]  52.01,28.25 0 top

## Tracks (layer width: path | path; a pad name or v marks a point on that pad's centre or on a via)
1.05  (via drill 0.3, 0.35)
  Top 0.152: v102.76,6.41 102.25,6.92 96.66,6.92 95.26,5.51 v93.99,5.51
  Bottom 0.152: v102.76,6.41 102.54,6.19 BMD-340.P48 | v93.99,5.51 93.63,5.51 93.19,5.95 82.43,5.95 76.29,12.1 76.29,26.19 74.87,27.62 74.87,30.41 82.35,37.89 82.35,38.63 83.24,39.52 83.67,39.52 87.82,43.67 87.82,50.17 78.57,59.42 78.57,67.55 72.48,73.64 72.48,74.5 71.89,75.09 71.62,75.09 68.8,77.91 68.8,86.72 66.13,89.39 64.43,89.39 64.1,89.72 61.86,89.72 59.96,91.63 EXPANSION.13
1.06  (via drill 0.3, 0.35)
  Top 0.152: v102.76,7.3 96.18,7.3 95,6.12 v94.84,6.12
  Bottom 0.152: BMD-340.P49 102.75,7.29 v102.76,7.3 | 69.13,86.82 69.13,78.01 71.74,75.39 72.02,75.39 72.78,74.63 72.78,73.85 78.88,67.75 78.88,59.54 88.13,50.3 88.13,43.54 83.79,39.21 83.37,39.21 82.65,38.5 82.65,37.77 77.32,32.44 77.32,26.87 76.59,26.15 76.59,12.22 82.48,6.33 93.38,6.33 93.58,6.13 94.83,6.13 v94.84,6.12 | EXPANSION.12 62.5,91.75 64.55,89.69 66.26,89.69 69.13,86.82 | 69.13,86.82
1.07  (via drill 0.3, 0.35)
  Top 0.152: v102.76,8.19 102.25,7.68 96.13,7.68 95.19,6.74 v94.02,6.74
  Bottom 0.152: BMD-340.P50 102.17,8.39 102.37,8.19 v102.76,8.19 | v94.02,6.74 82.51,6.74 77,12.25 77,26.12 77.63,26.75 77.63,32.31 82.96,37.64 82.96,38.37 83.49,38.91 83.92,38.91 88.43,43.42 88.43,50.43 79.18,59.67 79.18,67.88 73.09,73.97 73.09,74.75 72.14,75.7 71.87,75.7 69.43,78.14 69.43,86.95 65.04,91.35 EXPANSION.11
1.08  (via drill 0.3, 0.35)
  Top 0.152: v103.52,8.82 102.5,8.82 101.74,8.06 96.02,8.06 95.31,7.35 v94.84,7.35
  Bottom 0.152: v103.52,8.82 102.6,8.82 BMD-340.P51 | v94.84,7.35 93.41,7.35 93.1,7.04 82.64,7.04 77.3,12.37 77.3,25.99 77.93,26.62 77.93,32.18 83.26,37.52 83.26,38.25 83.62,38.6 84.04,38.6 88.73,43.29 88.73,50.55 79.49,59.8 79.49,68 73.39,74.1 73.39,74.88 72.27,76 72,76 69.74,78.26 69.74,87.08 67.07,89.74 67.07,91.24 67.58,91.75 EXPANSION.10
+3V1  (via drill 0.35)
  Top 0.203: LS1.N 153.5,12.83 v153.56,12.89
  Bottom 0.203: T6.3 D2.A 154.79,12.89 v153.56,12.89
+3V2  (via drill 0.35)
  Top 0.203: v172.1,13.27 169.54,13.27 LS2.N
  Bottom 0.203: T7.3 D69.A 172.1,13.3 v172.1,13.27
+3V3  (via drill 0.35)
  Top 0.254: v105.06,16.52 104.93,16.39 101.25,16.39 v101.24,16.4
  Top 0.305: v118.25,34.6 118.25,35.24 118.38,35.36
  Top 0.406: v41.29,34.48 41.29,35.75 | 41.29,35.75 40.02,37.02 33.99,37.02 33.77,37.23 32.13,37.23 31.91,37.02 31.89,37.02 30.62,35.75 28.33,35.75 v28.08,36 | 41.29,35.75 v63.89,35.75 118,35.75 118.38,35.36 118.6,35.14 119.67,35.14 120.54,36 183.02,36 v183.97,35.05 | v64.66,49.97 70.24,49.97 v71.77,51.49 81.71,51.49 82.45,50.75 84.24,50.75 85.23,51.75 v94.88,51.75 100.22,51.75 | 100.22,51.75 100.51,51.75 101.5,50.75 102.85,50.75 103.84,51.75 105.02,51.75 105.12,51.65 105.98,51.65 106.08,51.75 106.22,51.75 106.26,51.71 107.38,51.71 107.42,51.75 v111.52,51.75 119.56,51.75 120.55,50.75 121.9,50.75 122.89,51.75 138.61,51.75 139.6,50.75 140.95,50.75 141.94,51.75 v142.63,51.75 157.66,51.75 158.65,50.75 160,50.75 160.99,51.75 176.71,51.75 177.7,50.75 179.05,50.75 180.04,51.75 195.76,51.75 196.75,50.75 198.1,50.75 199.09,51.75 v212.99,51.75 214.81,51.75 215.8,50.75 217.15,50.75 218.14,51.75 v221.88,51.75 | v100.11,51.75 100.22,51.75 | 100.22,51.75 | LS2.P 176.11,14.61 176.16,14.66 v176.16,14.79 | v156.35,12.63 156.55,12.83 LS1.P 160.67,10.74 160.67,3.77 159.4,2.5 JP1.1 | v105.06,16.52 106.12,17.58 v113.17,17.58 | v42.43,29.65 43.32,29.65 47.13,25.84 50.95,25.84 50.99,25.79 53.03,25.79 53.07,25.84 v66.05,25.84 70,25.84 70.04,25.79 73.37,25.79 74.43,26.86 82.16,26.86 v82.16,26.77 85.95,26.77 87.01,25.71 v95.77,25.71
  Bottom 0.203: U5.24 168.5,6.36 C23.1
  Bottom 0.254: BMD-340.P17 v101.24,16.4 99.37,16.4 98.8,16.98 C26.1 | BMD-340.P65 105.09,16.55 v105.06,16.52
  Bottom 0.305: U3.8 114.55,11.1 117.23,13.77 118.63,13.77 119.52,14.66 119.52,16.7 118.63,17.58 | v118.25,34.6 118.63,34.22 118.63,17.58 | 118.63,17.58 v113.17,17.58 | v66.05,25.84 66.05,22.41 69.23,19.24 69.23,13.47 73.75,8.95 T5.3
  Bottom 0.406: C28.1 40.19,25.36 U$38.4 41.1,27.39 L1.2 41.32,29.65 | 41.32,29.65 41.32,34.44 v41.29,34.48 | v28.08,36 28.08,42.16 | R17.2 28.08,42.16 | 28.08,42.16 R18.2 | v63.89,35.75 64.91,36.76 64.91,48.7 64.27,49.33 | 64.27,49.33 61.99,51.62 U2.16 | T1.3 63.13,81.25 63.13,75.88 68.47,70.54 68.47,64.96 69.48,63.94 70.5,63.94 73.04,61.4 C6.1 70.1,57.19 69.61,56.7 U2.10 69.61,53.65 v71.77,51.49 | 64.27,49.33 64.27,49.59 v64.66,49.97 | T2.3 91.83,61.57 91.83,57.08 94.88,54.03 v94.88,51.75 | v221.88,51.75 222.26,52.13 222.26,53.78 | 222.26,53.78 U4.10 | C7.1 225.44,54.54 224.68,53.78 222.26,53.78 | U4.16 213.49,55.3 212.99,54.8 v212.99,51.75 | J5.3 132.62,85.15 | 132.62,85.15 132.62,77 142.63,66.99 v142.63,51.75 | v100.11,51.75 99.96,51.75 99.96,54.54 98.18,56.32 98.18,67.34 93.77,71.76 93.77,85.76 91.45,88.07 87.13,88.07 85.36,89.85 EXPANSION.3 | J4.2 152.04,88.33 151.02,87.31 144.92,87.31 142.13,90.1 134.25,90.1 132.6,88.45 132.6,85.16 132.62,85.15 | v183.97,35.05 184.04,35.11 184.29,34.86 184.29,30.79 182.38,28.89 182.38,25.97 176.16,19.74 v176.16,14.79 176.16,13.39 174.47,11.7 D69.K 173.37,5.65 170.95,3.23 169.02,3.23 | D2.K 154.91,11.23 155.84,11.23 156.35,11.74 v156.35,12.63 157.37,13.65 157.37,17.71 155.21,19.87 145.43,19.87 143.9,21.39 143.9,23.34 T4.3 | JP1.1 167.28,2.5 168.01,3.23 169.02,3.23 | T3.3 115.06,42.73 111.9,42.73 111.52,43.11 v111.52,51.75 | R19.1 81.08,26.85 82.07,26.85 v82.16,26.77 83.4,26.77 R1.1 | C22.1 98.8,19.46 C26.1 98.67,18.25 98.67,21.73 96.25,24.14 96.25,25.23 v95.77,25.71 | 41.32,29.65 v42.43,29.65 | C23.1 169.02,5.77 169.02,3.23
BATT_IN
  Bottom 0.203: U6.6 4.7,16.29 5.21,16.81 | U6.8 4.3,11.4 4.46,11.23 4.89,11.23 5.98,12.33 5.98,12.81 6.69,13.52 6.69,15.32 R3.1
  Bottom 0.406: X1.2 5.21,17.86 | 5.21,17.86 C29.1 | R3.1 5.21,16.81 5.21,17.86
BIN
  Bottom 0.203: U6.10 3.5,10.19 3.51,10.11 R6.1
BOOTLOAD  (via drill 0.3, 0.35)
  Top 0.152: v29.35,36.76 29.86,36.76 30.62,37.52 31.81,37.52 31.95,37.67 33.95,37.67 34.1,37.52 43.05,37.52 43.96,36.61 43.98,36.61 44.08,36.51 118.5,36.51 119.01,36 v119.01,35.87 | v115.58,9.08 107.07,9.08 v106.31,8.31
  Bottom 0.152: S2.3 S2.4 31.69,45.83 R18.1 32.66,43.86 33.16,43.37 33.16,41.59 29.1,37.52 29.1,37.02 v29.35,36.76 | BMD-340.P58 106.39,8.39 v106.31,8.31 | v119.01,35.87 119.01,17.74 121.3,15.46 121.3,11.23 120.18,10.12 120.18,9.35 118.84,8.01 116.65,8.01 v115.58,9.08
COL1  (via drill 0.35)
  Top 0.152: v12.46,56.45 13.8,57.79 61.91,57.79 v63.13,56.57
  Bottom 0.152: D1.A 13.91,75.68 13.29,75.06 D10.A 13.29,71 12.76,70.47 12.76,68.57 11.41,67.22 11.41,57.49 v12.46,56.45 12.46,56.33 D17.A | 12.71,56.19 15.63,53.27 15.63,50.48 13.91,48.76 13.91,45.81 11.57,43.46 11.57,39.04 15.89,34.73 | v63.13,56.57 63.26,56.45 U2.15 | 15.89,34.73 17.16,34.73 D24.A | 15.89,34.73 15.89,31.93 14.54,30.59 14.54,28.01 14.8,27.76 14.8,19.93 15.18,19.54 D31.A
  Bottom 0.203: 12.71,56.19 v12.46,56.45
COL2  (via drill 0.35)
  Top 0.152: v35.45,56.83 36.72,56.83 37.38,57.49 59.68,57.49 60.08,57.08 v60.59,57.08
  Bottom 0.152: D4.A 36.22,74.87 32.65,71.31 30.37,71.31 29.92,70.86 D11.A 29.92,69.07 30.17,68.82 30.17,62.86 35.45,57.59 v35.45,56.83 35.45,52.26 34.43,51.24 34.43,49.96 D18.A 34.49,40.63 25.34,31.49 D25.A 24.52,29.9 24.52,22.03 28.13,18.42 28.13,16.57 27.32,15.76 27.32,11.61 D32.A | v60.59,57.08 61.99,58.48 U2.1
COL3  (via drill 0.35)
  Top 0.152: v62.88,63.18 v49.16,63.18
  Bottom 0.152: D5.A 39.31,85.72 41.54,83.5 41.54,83.47 41.64,83.37 41.64,82.61 41.54,82.51 41.54,75.75 48.22,69.07 D12.A 48.71,63.18 | 48.71,63.18 48.71,57.02 53.54,52.2 D19.A 53.54,42.41 45.41,34.28 D26.A 45.41,27.67 48.97,24.12 48.97,17.65 51.25,15.37 D33.A | U2.2 63.26,62.8 v62.88,63.18 | v49.16,63.18 48.71,63.18
COL4
  Bottom 0.152: D6.A 58.17,87.81 58.17,78.66 D13.A 67.76,67.3 64.53,64.07 U2.3 64.53,58.99 65.67,57.84 67.96,57.84 68.97,56.83 68.97,53.33 72.59,49.72 | D20.A 72.59,49.72 | 72.59,49.72 72.59,42.15 63.13,32.7 63.13,30.78 D27.A
COL5  (via drill 0.35)
  Top 0.152: v86.25,64.19 85.74,64.19 85.23,63.69 66.94,63.69 v66.18,62.92
  Bottom 0.152: 86.75,64.19 86.75,69.02 D14.A 86.81,69.58 78.05,78.35 78.05,83.41 D7.A | D28.A 91.89,37.98 D21.A 91.89,53.97 86.75,59.11 86.75,64.19 | U2.4 65.8,62.54 v66.18,62.92 | v86.25,64.19 86.75,64.19
COL6  (via drill 0.35)
  Top 0.152: v67.45,62.42 68.36,63.33 70.37,63.33 70.42,63.28 104.13,63.28 104.79,63.94 v105.3,63.94 | v140.41,37.84 109.55,37.84 109.49,37.9 v109.36,37.9
  Bottom 0.152: D29.A 108.65,37.9 | 108.65,37.9 108.65,38.36 108.66,38.34 110.69,40.38 D22.A 110.69,57.02 105.8,61.91 105.8,63.94 | 105.8,63.94 105.8,69.02 D15.A 105.86,71.75 96.41,81.21 96.41,87.94 D8.A | U2.5 67.07,62.03 v67.45,62.42 | v105.3,63.94 105.8,63.94 | v109.36,37.9 108.65,37.9 | v140.41,37.84 140.41,37.33 137.17,34.09 137.17,26.09 D34.A
COL7  (via drill 0.35)
  Top 0.152: v68.72,62.42 69.33,63.02 70.24,63.02 70.29,62.97 123.89,62.97 124.6,63.69 v124.85,63.69
  Bottom 0.152: D9.A 115.51,79.88 124.91,70.48 D16.A 124.91,63.69 | 124.91,63.69 124.91,61.34 129.93,56.32 | D23.A 130.75,55.5 129.93,56.32 | D30.A 124.27,34.92 124.27,37.78 122.57,39.48 122.57,48.95 129.93,56.32 | U2.6 68.34,62.03 v68.72,62.42 | v124.85,63.69 124.91,63.69
COL8  (via drill 0.35)
  Top 0.152: v69.99,62.42 70.24,62.67 v143.96,62.67
  Bottom 0.152: D56.A 138.88,34.53 148.79,44.44 D49.A 148.79,55.75 143.96,60.58 v143.96,62.67 D42.A 136.34,76.69 D35.A | U2.7 69.61,62.03 v69.99,62.42
COL9  (via drill 0.35)
  Top 0.152: v215.53,56.83 214.57,57.79 164.43,57.79 163.97,57.34 v163.72,57.34
  Bottom 0.152: D36.A 153.61,79.88 163.01,70.48 D43.A 163.01,57.34 | 163.01,57.34 163.01,57.02 167.84,52.2 D50.A 167.84,42.92 158.19,33.26 D57.A | U4.15 215.91,56.45 v215.53,56.83 | v163.72,57.34 163.01,57.34
COL10  (via drill 0.35)
  Top 0.152: v274.33,66.73 273.7,66.1 273.7,64.96 272.43,63.69 264.3,63.69 262.52,61.91 251.35,61.91 250.33,62.92 215.53,62.92 v214.77,62.16 214.01,62.92 v183.02,62.92
  Bottom 0.152: D37.A 172.66,81.91 182.57,72.01 D44.A 182.57,62.92 | 182.57,62.92 182.57,55.75 186.89,51.43 D51.A 186.89,43.25 177.18,33.54 177.18,31.03 D58.A | D63.A 276.93,69.46 274.33,66.86 v274.33,66.73 | v214.77,62.16 214.64,62.03 U4.1 | v183.02,62.92 182.57,62.92
COL11  (via drill 0.35)
  Top 0.152: v215.28,63.69 v201.82,63.69
  Bottom 0.152: 201.11,63.69 201.11,54.72 D52.A 205.94,42.92 196.23,33.21 196.23,31.03 D59.A 196.29,17.9 194.38,15.99 D64.A | 201.11,63.69 D45.A 191.71,78.47 D38.A | U4.2 215.91,63.05 v215.28,63.69 | v201.82,63.69 201.11,63.69
COL12
  Bottom 0.152: D39.A 210.76,79.88 220.16,70.48 D46.A 220.16,66.03 217.18,63.05 U4.3 217.18,56.52 217.71,55.99 217.71,54.39 222.21,49.9 | D53.A 222.21,49.9 | 222.21,49.9 222.21,42.68 215.34,35.8 D60.A 215.34,11.67 D65.A
COL13  (via drill 0.35)
  Top 0.152: v219.34,63.69 v238.14,63.69
  Bottom 0.152: D40.A 229.81,80.39 239.21,70.99 D47.A 239.21,63.69 | 239.21,63.69 239.21,58.55 244.04,53.72 D54.A 244.04,43.93 234.39,34.28 D61.A 234.39,21.21 239.34,16.26 D66.A | U4.4 218.45,62.8 v219.34,63.69 | v238.14,63.69 239.21,63.69
COL14  (via drill 0.35)
  Top 0.152: v279.29,50.73 279.03,50.48 271.14,50.48 270.28,51.34 269.04,51.34 267.92,50.22 261.87,50.22 260.75,51.34 258.1,51.34 v257.7,51.75 | v219.85,62.16 219.85,62.25 220.09,62.5 250.32,62.5 251.22,61.6 253.68,61.6 v254.14,61.15
  Bottom 0.152: D41.A 248.86,75.92 254.72,70.06 254.72,61.15 | D67.A 263.16,11.87 259.05,11.87 254.65,16.27 254.65,25.92 256.22,27.49 256.22,28.93 257.19,29.9 257.19,33.71 255.98,34.92 D62.A 255.41,35.12 255.41,49.46 D55.A 255.92,50.08 255.92,50.99 256.32,51.39 256.32,51.75 | 254.72,61.15 254.72,54.62 256.32,53.02 256.32,51.75 | v257.7,51.75 256.32,51.75 | D48.A 280.61,62.23 280.61,52.56 279.29,51.24 v279.29,50.73 | U4.5 219.72,62.03 v219.85,62.16 | v254.14,61.15 254.72,61.15
D+  (via drill 0.35)
  Top 0.203: v18.68,73.85 41.03,73.85 42.1,72.78 57.25,72.78 58.14,73.67 60.24,73.67 61.33,72.58 76.34,72.58 77.1,73.34 77.11,73.34 77.44,73.67 79.3,73.67 79.63,73.34 79.64,73.34 80.4,72.58 95.39,72.58 96.15,73.34 96.16,73.34 96.49,73.67 102.63,73.67 v103.42,72.88
  Bottom 0.203: v18.68,73.85 18.17,73.85 17.72,74.3 17.72,77.09 16.96,77.85 R9.2 | v103.42,72.88 104.03,72.27 104.03,59.37 108.47,54.93 108.47,52.37 108.46,52.36 108.46,44.84 108.75,44.55 108.75,42.43 108.46,42.14 108.46,39.07 102.76,33.36 102.76,26.17 108.09,20.84 108.09,15.09 BMD-340.P68
D-  (via drill 0.35)
  Top 0.203: v102.35,72.88 102.35,72.93 101.97,73.31 96.63,73.31 96.28,72.95 95.54,72.22 80.26,72.22 79.52,72.96 79.51,72.96 79.16,73.31 77.58,73.31 77.23,72.96 76.49,72.22 61.18,72.22 60.09,73.31 58.28,73.31 57.4,72.42 41.95,72.42 41.29,73.08 41.28,73.08 40.93,73.44 23.1,73.44 22.75,73.08 v21.73,73.08
  Bottom 0.203: R10.2 21.02,77.85 20.26,77.09 20.26,74.04 21.22,73.08 v21.73,73.08 | v102.35,72.88 103.67,71.56 103.67,59.22 108.11,54.77 108.11,52.51 108.11,44.69 108.39,44.41 108.39,42.58 108.11,42.29 108.11,39.34 102.4,33.63 102.4,26.03 107.71,20.72 107.71,15.21 BMD-340.P67
GND  (via drill 0.3, 0.35)
  Bottom 0.203: U7.6 4.46,57.34 U7.EP v4.33,57.97 3.96,58.34 U7.8 | U7.4 3.95,56.1 3.95,55.56 3.7,55.3 2.68,55.3 v2.17,55.81
  other vias: 2.93,59.88 1.66,57.59 6.49,55.3 8.78,55.05 10.17,60.51 7.51,62.54 13.6,69.78 12.33,63.94 278.27,42.86 283.35,42.6 21.22,43.62 28.33,44 1.28,16.95 8.27,16.95 10.93,16.26 6.49,7.55 1.71,14.43 1.71,13.42 24.27,77.15 29.55,72.22 25.29,72.32 21.48,70.04 31.89,78.67 33.41,75.12 261.63,20.2 255.66,18.22 253.38,18.47 253.89,22.54 260.74,16.37 263.03,15.6 15.99,86.42 17.03,81.9 23.13,83.17 70.88,59.04 74.56,55.48 99.83,31.86 96.28,30.97 105.68,26.4 96.66,22.08 89.29,11.16 98.82,5.57 97.04,16.62 110.76,16.11 104.53,8.24 112.28,7.86 115.46,10.9 142.63,21.32 133.49,21.45 87.39,14.71 84.72,21.95 78.75,21.83 82.05,11.79 106.04,10.74 105.17,9 103.9,7.35 105.17,7.35 103.9,5.57 105.17,5.57 110.5,5.44 111.77,5.44 113.04,5.44 111.39,7.73 116.73,9.13 120.15,0.74 121.55,0.74 120.03,5.19 121.42,5.82 120.66,7.86 123.58,6.33 126.38,6.33 126.89,3.41 128.16,7.35 126.38,7.6 123.46,12.68 124.47,12.68 124.47,15.86 123.84,14.84 127.9,15.1 128.03,13.44 129.68,13.57 130.57,15.48 130.95,12.17 134.63,12.3 136.66,15.48 136.92,13.44 136.03,11.03 132.98,7.22 135.01,7.22 138.44,7.22 136.79,4.43 138.44,2.9 134.89,3.28 136.28,2.01 141.62,11.92 145.68,11.79 140.47,13.32 142.76,13.32 147.46,13.32 109.11,16.11 110.76,14.71 110.76,13.44 112.28,16.11 112.28,14.71 112.28,13.44 114.19,16.75 115.58,16.75 114.95,15.6 113.93,14.33 110.5,18.4 112.15,18.4 115.07,18.4 117.49,18.4 98.44,15.35 95.64,17.89 95.64,18.91 95.01,16.37 95.01,14.59 96.79,13.19 96.53,5.57 97.68,6.21 92.6,5.32 90.18,5.32 87.9,5.32 87.64,8.05 83.17,8.05 85.34,8.03 84.34,11.79 79.64,11.79 78.37,13.32 78.37,15.35 83.96,14.84 82.05,14.84 89.29,12.68 89.29,14.21 93.23,16.37 93.23,14.59 93.23,18.02 94.63,21.19 93.61,22.59 94.63,23.99 94.63,26.65 96.41,26.78 86.88,21.95 82.44,21.95 70.62,17 70.62,18.14 73.24,18.3 73.8,14.84 71.64,12.68 68.08,13.32 68.08,14.97 66.56,13.32 69.23,10.02 67.45,10.65 65.42,10.65 74.31,22.21 75.96,7.86 79.01,7.86 67.58,23.22 65.16,23.73 65.16,21.57 62.88,16.24 62.88,18.27 54.11,15.48 54.11,18.27 52.46,18.27 52.46,15.48 60.21,12.3 53.61,13.32 56.4,20.94 56.4,23.6 63,23.6 61.73,26.91 61.61,32.49 55.89,26.78 59.19,32.49 54.75,30.59 56.91,32.62 58.56,34.4 62.24,34.53 63.77,37.83 66.18,37.96 61.61,37.83 66.43,34.4 71.26,34.4 76.47,34.4 70.37,31.61 63.77,27.03 68.08,27.16 64.4,32.49 76.21,30.34 79.9,28.43 83.07,28.43 81.04,32.49 88.02,32.11 86.75,27.41 83.71,34.65 86.88,34.53 91.33,31.1 94.88,32.37 95.77,34.53 89.04,38.08 96.41,38.08 89.04,40.11 93.87,39.86 93.74,43.29 104.28,41.64 104.03,45.32 101.87,45.19 93.74,45.32 90.94,45.7 84.85,43.04 78.63,37.96 70.12,37.83 72.02,40.11 74.43,43.42 74.43,45.32 79.9,50.27 84.85,45.32 85.61,50.27 66.18,39.73 65.93,49.13 68.34,49.13 65.93,50.78 67.32,50.78 70.75,46.97 71.13,43.29 69.48,51.42 66.18,57.01 67.45,57.01 63,59.04 66.18,59.29 67.58,59.29 73.04,54.08 74.56,54.08 72.02,60.82 66.18,64.24 64.78,65.9 62.88,64.5 60.21,64.63 60.21,62.21 61.86,62.21 60.72,55.48 60.72,53.83 56.78,56.37 56.78,53.2 53.73,53.32 50.43,56.75 50.43,58.91 52.46,39.73 51.07,37.96 56.78,39.73 54.5,48.12 60.46,50.4 50.56,34.4 48.91,27.41 39.76,20.94 37.1,20.94 37.1,23.1 37.1,25 44.84,20.94 46.75,20.94 45.73,21.95 44.34,25.89 39.76,26.65 39.76,29.57 39.76,32.37 36.97,30.59 38.62,23.1 38.49,25 38.62,20.94 42.05,24.11 42.05,25.51 38.62,18.14 39.76,18.14 37.1,18.14 44.84,18.14 46.75,18.14 46.75,16.11 48.27,14.33 49.54,15.86 49.8,18.14 42.81,13.57 40.91,11.92 49.03,12.81 51.07,9.51 51.07,2.27 55.13,5.06 63.26,5.95 65.42,7.6 62.88,0.87 60.34,0.74 46.37,3.28 43.83,6.46 69.99,0.87 74.69,4.94 69.74,6.84 69.99,2.65 87.9,3.16 87.9,1.13 85.61,5.32 83.07,5.19 80.53,6.21 77.61,0.87 30.62,2.01 17.79,2.01 19.82,4.81 29.22,4.94 24.52,6.71 24.27,13.32 24.27,15.22 19.7,15.22 19.7,13.19 22.87,17.38 22.75,19.16 26.43,15.22 28.21,15.22 30.87,15.22 29.86,12.94 36.21,12.3 35.95,15.35 33.92,15.48 28.59,21.45 28.59,26.53 27.44,32.49 32.65,31.48 30.49,26.53 35.57,35.8 39,35.8 42.81,36.69 35.57,39.61 39,39.61 35.45,47.86 33.54,47.86 33.41,45.19 29.48,40.37 26.56,40.37 29.86,44.05 24.27,40.5 26.3,36.05 20.71,34.27 20.71,32.24 20.71,37.32 20.71,39.61 17.67,44.43 16.52,36.81 17.28,51.29 17.41,53.96 23.63,54.34 25.03,48.5 24.9,45.19 34.56,53.32 36.33,53.32 34.3,56.5 23.76,56.24 20.59,56.62 20.59,59.16 27.19,59.04 32.4,59.04 33.29,61.7 17.28,69.2 14.11,56.62 16.27,56.62 103.77,32.37 106.06,34.53 27.32,77.15 19.44,72.58 16.27,73.72 16.27,75.62 15.63,77.78 21.48,75.88 19.44,75.75 19.44,77.27 22.87,79.18 21.22,81.85 25.16,83.24 24.78,91.5 16.9,93.66 20.33,93.66 25.16,86.67 12.46,85.53 12.2,88.58 4.08,89.97 2.55,92.01 3.31,81.21 3.19,76.77 1.16,76.77 8.27,76.51 9.03,79.18 9.03,81.34 8.27,73.72 11.19,70.8 24.9,61.53 1.16,44.13 1.16,41.97 6.49,44 3.95,47.18 11.82,52.26 10.05,50.22 3.95,51.24 5.73,51.24 9.28,62.54 0.9,68.13 2.55,68.13 7.51,68.38 9.28,64.32 3.95,49.21 5.73,49.21 1.16,34.22 1.28,26.09 7.63,26.22 2.81,20.63 1.54,20.63 2.17,19.62 6.49,21.01 6.36,18.98 2.04,7.04 1.79,11.23 6.49,6.28 3.31,7.04 4.58,7.04 5.09,8.19 5.09,10.35 1.79,4.25 3.44,2.6 4.97,0.95 5.6,4.5 17.79,7.42 15.25,12.12 12.97,16.06 17.28,16.57 17.28,19.36 16.4,21.9 16.4,25.46 11.95,19.18 13.09,25.53 10.17,32.14 12.97,35.82 44.72,55.99 44.59,59.29 44.34,70.34 36.46,70.21 36.97,79.74 39.51,77.96 43.83,83.04 42.94,78.34 53.86,78.34 49.03,74.4 55.64,74.15 61.1,78.6 63,84.18 59.19,86.34 53.86,93.07 45.73,89.64 45.61,91.42 53.86,91.42 33.03,92.06 31.38,86.85 36.72,88.25 73.67,89.26 73.93,91.93 73.42,85.83 64.66,87.87 58.69,91.3 75.45,81.39 75.45,78.09 68.47,74.02 79.39,69.45 80.78,64.63 80.78,61.83 84.72,61.7 84.85,59.16 86.5,56.75 88.79,54.85 78.5,57.01 80.28,54.59 72.66,65.26 84.09,69.58 84.98,66.4 93.61,69.45 91.58,65.01 89.8,57.26 92.72,54.85 94.5,56.75 97.68,54.85 100.85,56.12 99.71,60.43 99.45,69.2 91.2,78.72 91.2,81.39 80.02,79.99 82.05,84.44 89.29,86.47 84.09,91.93 78.5,89.01 92.98,93.33 92.98,91.68 94.88,93.33 89.8,73.39 91.33,73.39 80.02,77.96 80.91,73.52 88.15,70.59 97.17,78.47 99.07,80.63 97.55,84.06 104.53,93.33 113.55,84.06 116.6,84.06 113.55,80.63 116.73,80.63 119.52,72.75 107.84,73.13 110.63,64.5 108.98,61.2 106.18,59.55 113.04,56.12 108.98,56.5 120.92,56.24 120.79,60.56 120.66,64.24 120.54,69.96 126.89,72.75 126.76,83.93 126.63,80.75 129.93,80.88 129.93,77.83 129.93,87.61 134,88.37 129.93,89.39 129.93,91.55 135.27,91.55 141.11,93.45 125.87,92.69 125.62,87.87 122.82,89.01 112.92,89.52 114.19,92.69 126,55.99 47.76,43.92 49.42,50.91 141.11,88.63 145.68,84.18 150.25,85.33 147.59,88.76 147.59,91.8 151.02,91.3 156.98,91.3 155.21,88.88 156.35,83.29 149.36,79.48 147.71,73.13 138.95,78.09 150.38,70.34 144.79,70.47 140.86,64.88 141.24,69.83 140.73,60.31 140.6,55.99 144.54,55.99 132.47,55.48 129.3,64.12 127.77,41.26 143.27,42.02 135.14,30.97 124.22,25.26 127.52,34.53 127.39,31.86 133.49,34.65 141.11,34.65 139.2,28.3 136.92,20.94 143.9,11.92 142.63,22.72 142.63,26.4 151.52,21.32 156.1,14.97 152.92,14.97 151.27,18.02 158.51,17 158.51,9.63 147.33,11.03 149.24,12.05 149.11,5.95 147.21,3.16 148.98,1.89 146.57,6.97 150.89,10.65 150.76,8.36 154.95,5.06 154.95,6.71 155.08,0.74 168.67,2.14 172.22,5.95 172.22,7.86 172.1,2.01 175.53,1.89 175.78,8.24 174.51,8.24 178.32,8.24 178.32,5.19 182.38,5.19 182.26,7.09 171.34,12.43 171.34,14.97 167.65,14.97 165.11,3.79 161.81,3.67 163.46,4.81 164.73,6.46 162.95,6.97 164.1,62.34 162.06,62.34 161.18,17 158.64,21.19 154.57,31.61 146.44,31.99 176.8,23.48 176.8,28.94 170.83,23.99 171.21,30.84 165.37,32.11 165.24,34.4 172.73,37.45 170.07,41 180.48,43.67 174.76,50.4 175.02,54.34 169.05,55.48 178.45,62.09 178.45,69.96 171.59,70.59 169.94,72.25 167.53,72.25 169.43,70.21 158,72.37 155.84,69.2 153.3,78.34 156.98,78.47 169.68,78.72 169.43,83.29 160.92,88.76 169.56,89.14 158.51,93.45 170.7,93.58 186.32,93.58 188.48,88.25 180.23,88.76 188.61,79.74 193.81,79.74 188.48,74.66 183.4,74.4 195.72,72.37 203.97,73.26 203.85,74.91 205.88,73.26 199.91,73.13 195.85,78.21 193.69,78.21 205.12,78.98 209.82,73.26 207.53,70.47 201.82,70.72 202.83,64.88 199.91,64.37 202.58,60.31 211.47,64.63 212.74,59.16 202.58,55.99 199.4,55.99 187.34,55.74 192.8,56.12 196.74,60.43 193.31,69.32 188.86,69.83 184.16,60.43 184.16,64.37 185.81,45.96 180.61,50.02 194.32,50.4 190.51,39.86 185.31,39.86 190.51,37.83 191.4,34.4 192.54,31.99 186.83,30.97 184.67,36.3 181.75,34.4 196.23,34.65 203.59,35.67 203.85,31.73 197.62,26.91 200.42,24.11 197.75,24.11 194.58,23.86 197.75,21.95 194.58,21.32 191.02,21.45 186.83,25.64 180.48,22.21 212.48,37.7 207.02,40.62 219.21,49.89 219.21,42.91 213.88,35.03 212.74,28.05 212.48,22.46 213.37,17.13 207.53,17.25 209.05,17.25 209.05,15.48 204.99,16.49 196.48,16.37 199.4,13.95 205.75,11.92 209.56,11.41 194.45,6.46 185.43,8.49 184.42,2.01 196.23,2.01 209.44,4.17 211.85,1.25 219.47,1.25 215.91,4.17 213.5,11.41 227.22,12.3 231.53,6.71 232.42,15.6 234.96,3.03 217.94,17.13 217.82,22.59 222.64,31.73 222.39,36.18 230.26,36.3 231.53,29.07 230.39,22.84 236.23,17.13 236.87,22.72 239.79,36.05 238.65,42.27 225.69,41.26 225.56,46.72 231.66,51.16 223.02,51.42 226.83,57.39 228.36,57.39 228.36,55.23 231.03,55.1 230.9,57.39 232.93,59.04 237.76,59.16 236.99,49.89 242.2,50.15 242.33,53.58 225.69,53.32 222.77,57.26 218.45,57.13 218.45,59.04 222.77,59.04 224.93,61.07 215.53,59.04 212.74,62.09 211.72,55.48 217.06,49.26 212.23,49.64 209.69,55.86 224.8,65.01 217.82,70.34 216.8,72.5 212.23,80.25 211.85,83.55 208.29,88.5 208.29,93.45 227.72,88.12 226.58,79.36 232.8,73.77 220.99,74.28 235.22,69.2 239.41,74.28 246.14,74.28 252.11,69.2 246.01,79.74 245.88,85.58 245.76,92.95 264.3,92.95 265.44,88.76 250.2,84.06 250.2,79.99 259.22,76.82 256.17,74.66 251.47,77.07 261.12,79.23 264.43,75.04 264.43,73.13 261.12,73.26 268.24,75.17 262.65,70.59 264.43,65.01 267.35,65.01 262.14,62.72 263.54,60.94 266.08,61.45 260.49,61.07 256.43,59.8 253,59.04 252.49,63.23 243.73,64.37 245.5,55.74 252.23,50.66 257.57,55.1 261.89,51.42 260.24,53.32 265.06,59.04 267.35,48.88 269.51,45.45 257.82,45.19 257.7,42.65 257.44,35.67 258.2,31.99 249.06,32.24 245.76,42.27 265.44,35.54 268.62,40.88 272.05,38.34 275.86,34.78 274.59,31.35 268.24,31.73 264.3,25.51 264.43,21.06 253.89,24.37 253.89,26.65 251.98,29.95 256.55,26.65 253.89,36.56 242.2,31.61 239.41,27.16 246.14,23.6 249.82,18.52 242.71,17.25 254.52,11.54 259.35,9.76 236.36,13.19 259.47,2.52 283.22,2.01 278.27,11.67 276.87,17.25 267.86,15.86 268.11,18.78 264.43,18.65 263.03,16.75 260.62,13.06 255.92,22.46 255.92,24.37 251.98,26.65 246.01,26.78 272.43,23.48 272.43,27.03 279.16,24.11 280.43,31.1 281.7,47.73 283.6,17.64 283.73,33.26 277.76,57.77 278.27,65.64 271.92,59.93 272.55,69.2 272.81,75.8 281.19,72.5 282.97,80.75 276.24,81.26 271.54,87.99 279.03,86.6 283.86,90.28 282.21,93.07 280.81,89.14 271.41,92.95 261.76,83.42 270.4,79.99 113.8,22.46 116.6,22.46 116.6,26.4 116.47,32.11 117.87,50.4 109.74,46.46 116.22,44.81 123.71,42.91 120.66,31.1 138.82,15.22 162.95,7.98 163.97,7.98 164.73,9 165.75,16.87 161.18,21.32 42.43,31.1 42.94,34.53 46.24,29.95 50.56,31.86 48.4,6.46 4.33,57.21 5.09,57.21 5.09,57.97 3.19,14.41 4.2,14.41 3.19,13.39 4.2,13.39 8.52,93.66 47.13,37.96 48.65,39.73 51.7,42.78 39.51,81.52 40.14,83.93 40.4,85.71 38.24,86.22 35.32,84.69 50.18,87.23 71.26,87.61 70.88,83.8 76.47,89.26 56.53,88.12 67.96,82.91 71.77,80.25 74.69,83.68 92.47,84.06 93.99,87.74 114.19,78.09 118.63,78.47 117.23,12.68 117.61,10.78
  pour Bottom: -0.06,2.38 arc90 2.48,-0.17 281.88,-0.17 arc90 285.05,3.01 285.05,91.27 arc90 281.88,94.45 2.48,94.45 arc90 -0.06,91.91
  pour Top: -0.06,2.38 arc90 2.48,-0.17 281.88,-0.17 arc90 285.05,3.01 285.05,91.27 arc90 281.88,94.45 2.48,94.45 arc90 -0.06,91.91
  pour Route2: -0.06,2.63 arc90 2.48,0.09 281.88,0.09 arc90 285.05,3.26 285.05,91.53 arc90 281.88,94.7 2.48,94.7 arc90 -0.06,92.16
  pour Route15: 0.19,2.38 arc90 2.73,-0.17 282.13,-0.17 arc90 285.31,3.01 285.31,91.27 arc90 282.13,94.45 2.73,94.45 arc90 0.19,91.91
  pour Bottom (no thermals): 1.92,69.02 1.92,52.26 3.7,50.48 7,50.48 9.28,52.76 9.28,54.67 10.93,56.32 10.93,65.08 6.49,69.53 2.43,69.53
  pour Bottom (no thermals): 0.65,21.27 0.65,7.3 1.92,6.03 4.71,6.03 5.35,6.66 5.35,10.47 5.98,11.11 5.98,12.38 7,13.39 9.28,13.39 10.05,14.16 10.05,16.95 9.54,17.46 8.52,17.46 6.49,19.49 6.49,20.76 4.97,22.28 1.66,22.28
GPOUT  (via drill 0.3)
  Top 0.152: v102.88,9.49 97.83,9.49 97.04,8.69 81.42,8.69 74.43,1.71 69.61,1.71 64.66,6.66 51.32,6.66 48.91,4.25 v48.91,4.12
  Bottom 0.152: U6.12 2.7,11.12 1.41,9.84 1.41,6.71 7.08,1.04 46.41,1.04 48.91,3.54 v48.91,4.12 | BMD-340.P52 102.41,10.59 102.88,10.12 v102.88,9.49
L_BLANK  (via drill 0.35)
  Top 0.152: v145.81,16.06 145.35,16.52 123.41,16.52 121.65,14.76 v118.57,14.76
  Bottom 0.152: BMD-340.P34 113.46,11.14 116.52,14.2 117.09,14.2 117.65,14.76 v118.57,14.76 | U5.21 165.47,8.29 162.45,5.27 157.6,5.27 148.76,14.1 147.76,14.1 v145.81,16.06
L_LAT  (via drill 0.35)
  Top 0.152: v148.68,15.47 146.7,17.46 122.57,17.46 121.81,16.7 118,16.7 117.05,15.75 117.05,15.14 v116.79,14.89
  Bottom 0.152: BMD-340.P33 113.37,11.69 116.19,14.51 116.41,14.51 v116.79,14.89 | U5.4 155.86,8.29 v148.68,15.47
L_SCLK  (via drill 0.35)
  Top 0.152: v147.73,15.57 147.73,16 146.57,17.15 122.9,17.15 121.81,16.06 v118.5,16.06
  Bottom 0.152: BMD-340.P31 113.33,12.79 116.6,16.06 v118.5,16.06 | U5.3 156.09,7.63 148.86,14.87 148.43,14.87 v147.73,15.57
L_SIN  (via drill 0.35)
  Top 0.152: v146.82,15.93 145.94,16.82 123.08,16.82 121.83,15.58 118.88,15.58 118.76,15.45 v117.74,15.45
  Bottom 0.152: BMD-340.P32 113.29,12.24 116.6,15.55 117.64,15.55 v117.74,15.45 | U5.2 156.27,7.02 148.76,14.54 147.84,14.54 146.82,15.55 v146.82,15.93
LCOL1  (via drill 0.35)
  Top 0.152: ESC.LED- 7.88,92.16 ESC.SMDLED- | TAB.LED- 15.18,59.59 TAB.SMDLED- | CAPS2.LED- 12.8,40.54 CAPS2.SMDLED- | CAPS1.LED- 17.56,40.54 CAPS1.SMDLED- | LSH2.LED- 22.32,21.5 LSH2.SMDLED- | LSH1.LED- 12.8,21.49 LSH1.SMDLED- | MOD1A.LED+ 10.26,1.75 10.55,1.46 14.22,1.46 MOD1B.SMDLED-
  Top 0.203: LSH1.LED- 17.28,23.17 18.68,24.57 20.93,24.57 LSH2.LED- | CAPS2.LED- 12.8,43.07 13.6,43.87 15.91,43.87 CAPS1.LED- | v14.62,74.86 25.92,74.86 26.29,74.48 28.21,74.48 29.02,75.29 31.56,75.29 32.22,75.95 81.21,75.95 82.43,74.74 88.11,74.74 89.33,75.95 138.36,75.95 139.58,74.74 145.26,74.74 146.48,75.95 177.36,75.95 177.69,75.62 v177.94,75.62 | MOD1A.LED+ 10.26,2.45 MOD1A.SMDLED+ | MOD1B.SMDLED- 15.21,4.12 MOD1B.LED-